# Altium schematic sheet GSM.SchDoc
size A4; PageSetup: Record=PageOptions|CenterHorizontal=True|CenterVertical=True|PrintScale=0.97|XCorrection=1.00|YCorrection=1.00|PrintKind=1|BorderSize=5000000|LeftOffset=0|BottomOffset=0|Orientation=2|PaperLength=1000|PaperWidth=1000|Scale=100|PaperSource=7|PrintQuality=-4|MediaType=1|DitherType=10|PaperKind=A4, 210x297 mm|PrintScaleMode=1
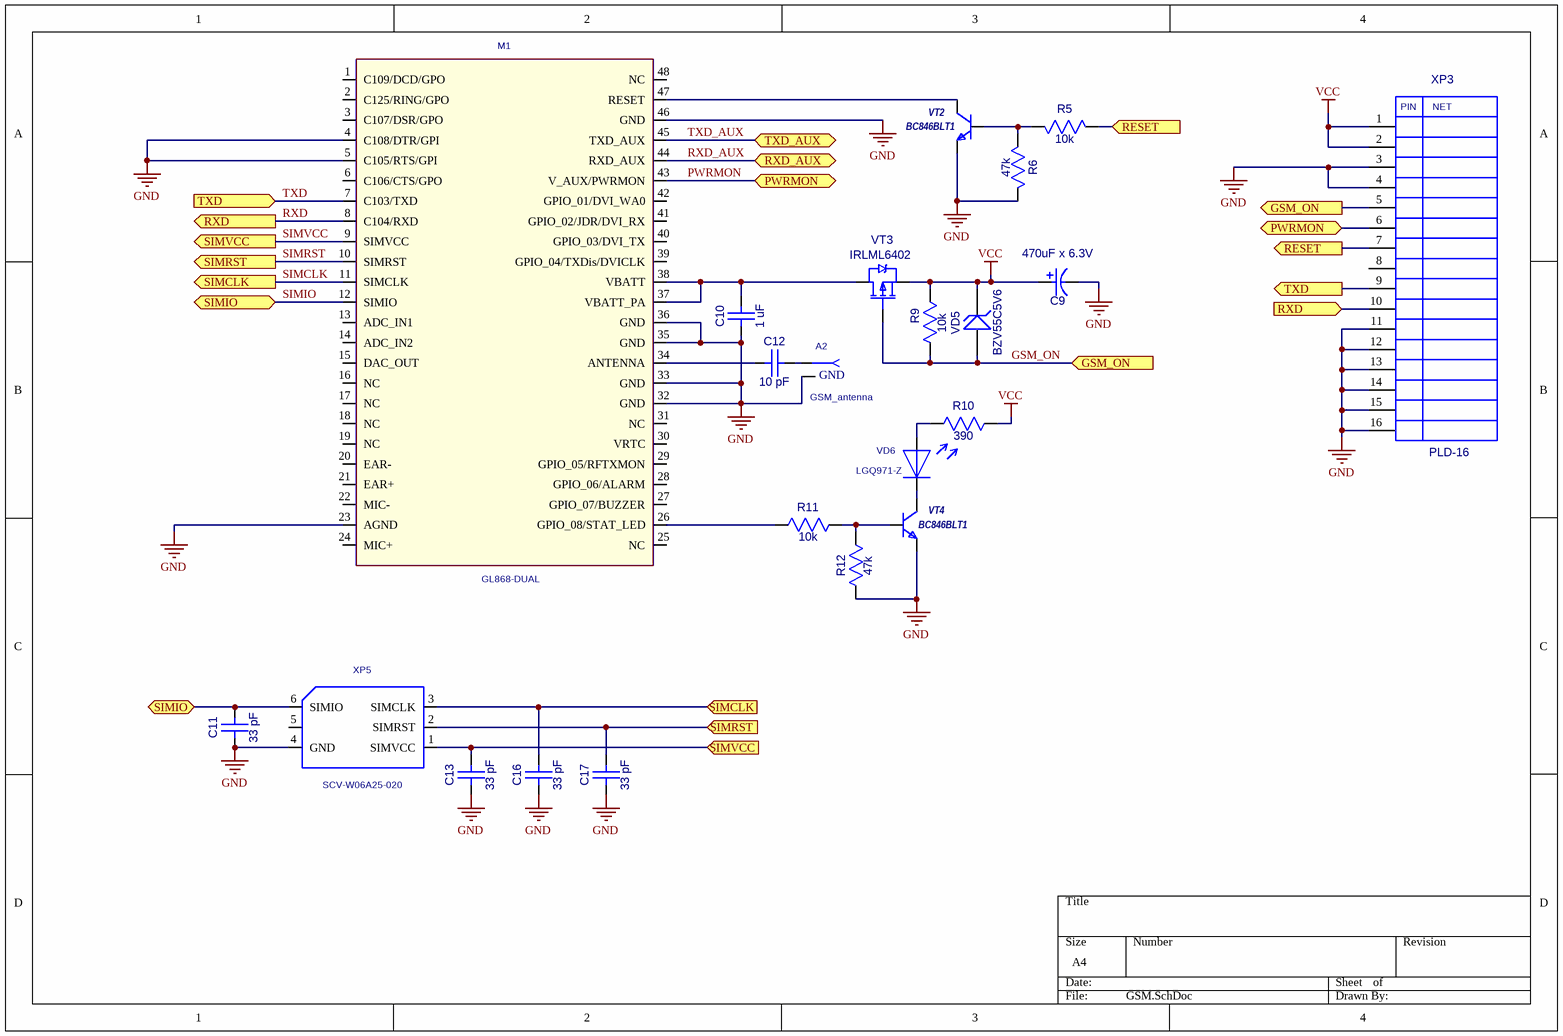
[diagram p0: GSM.SchDoc]

## Parts
A2  GSM_antenna  [GSM_antenna_pad]
C9  470uF x 6.3V  [TAJ-D-1M]
C10  1 uF  [CC0603-3M]
C11  33 pF  [CC0603-3M]
C12  10 pF  [CC0603-3M]
C13  33 pF  [CC0603-3M]
C16  33 pF  [CC0603-3M]
C17  33 pF  [CC0603-3M]
M1  GL868-DUAL  [GL868-DUAL]
R5  10k  [RC0603-3M]
R6  47k  [RC0603-3M]
R9  10k  [RC0603-3M]
R10  390  [RC0603-3M]
R11  10k  [RC0603-3M]
R12  47k  [RC0603-3M]
VD5  BZV55C5V6  [SOD80]
VD6  LGQ971-Z  [LED0603]
VT2  BC846BLT1  [SOT-23(123)]
VT3  IRLML6402  [SOT-23(123)]
VT4  BC846BLT1  [SOT-23(123)]
XP3  PLD-16  [PIN16]
XP5  SCV-W06A25-020  [SCVW06A25020]

## Ports
GSM_ON (in), GSM_ON (out), PWRMON, RESET (in), RESET (out), RXD (in), RXD (out), RXD_AUX, SIMCLK (in), SIMCLK (out), SIMIO, SIMIO (bidir), SIMRST (in), SIMRST (out), SIMVCC (in), SIMVCC (out), TXD (in), TXD (out), TXD_AUX

## Nets
GND: A2.2 C9.2(B) C10.1(A) C11.1(A) C13.1(A) C16.1(A) C17.1(A) M1.4(C108/DTR/GPI) M1.5(C105/RTS/GPI) M1.23(AGND) M1.32(GND) M1.33(GND) M1.35(GND) M1.36(GND) M1.46(GND) R6.2(B) R12.2(B) VT2.2(E) VT4.2(E) XP3.3 XP3.4 XP3.11 XP3.12 XP3.13 XP3.14 XP3.15 XP3.16 XP5.4(GND)
VCC: C9.1(A) R9.1(A) R10.2(B) VD5.2 VT3.2(S) XP3.1 XP3.2
GSM_ON: R9.2(B) VD5.1(A) VT3.1(G) XP3.5 ; port GSM_ON
PWRMON: M1.43(V_AUX/PWRMON) XP3.6 ; port PWRMON
RESET: R5.1(A) XP3.7 ; port RESET
RXD: M1.8(C104/RXD) XP3.10 ; port RXD
RXD_AUX: M1.44(RXD_AUX) ; port RXD_AUX
SIMCLK: C16.2(B) M1.11(SIMCLK) XP5.3(SIMCLK) ; port SIMCLK
SIMIO: C11.2(B) M1.12(SIMIO) XP5.6(SIMIO) ; port SIMIO
SIMRST: C17.2(B) M1.10(SIMRST) XP5.2(SIMRST) ; port SIMRST
SIMVCC: C13.2(B) M1.9(SIMVCC) XP5.1(SIMVCC) ; port SIMVCC
TXD: M1.7(C103/TXD) XP3.9 ; port TXD
TXD_AUX: M1.45(TXD_AUX) ; port TXD_AUX
NetA2_1: A2.1 C12.2(B)
NetC10_2: C10.2(B) M1.37(VBATT_PA) M1.38(VBATT) VT3.3(D)
NetC12_1: C12.1(A) M1.34(ANTENNA)
NetM1_26: M1.26(GPIO_08/STAT_LED) R11.1(A)
NetM1_47: M1.47(RESET) VT2.3(C)
NetR5_2: R5.2(B) R6.1(A) VT2.1(B)
NetR10_1: R10.1(A) VD6.1
NetR11_2: R11.2(B) R12.1(A) VT4.1(B)
NetVD6_2: VD6.2 VT4.3(C)

Not connected (* = marked no-connect by the designer): M1 1(C109/DCD/GPO) 2(C125/RING/GPO) 3(C107/DSR/GPO) 6(C106/CTS/GPO) 13(ADC_IN1) 14(ADC_IN2) 15(DAC_OUT) 16(NC) 17(NC) 18(NC) 19(NC) 20(EAR-) 21(EAR+) 22(MIC-) 24(MIC+) 25(NC) 27(GPIO_07/BUZZER) 28(GPIO_06/ALARM) 29(GPIO_05/RFTXMON) 30(VRTC) 31(NC) 39(GPIO_04/TXDis/DVICLK) 40(GPIO_03/DVI_TX) 41(GPIO_02/JDR/DVI_RX) 42(GPIO_01/DVI_WA0) 48(NC); XP3 8; XP5 5

## Notes on the sheet
- (in symbol GSM_antenna_pad) GND
- (in symbol PLD-16) PIN; NET

## Library data of the parts
A2 = GSM_antenna_pad: Value: *
C9 = TAJ-D: Value: 470uF x 6.3V
C10-C13 C16 C17 = CC0603
  C10: Value: 1 uF
  C11 C13 C16 C17: Value: 33 pF
  C12: Value: 10 pF
R5 R6 R9-R12 = RC0603
  R5 R9 R11: Value: 10k
  R6 R12: Value: 47k
  R10: Value: 390
VD5 = BZV55C5V1: Zener Voltage Regulator Diode; OriginalName: BZX84C10LT1; ComponentField6: Pin 2 is not connected and not drawn.; ComponentField7: Published 29-Sep-2000; Value: BZV55C5V6
VD6 = LED_0603: Value: LGQ971-Z
VT2 VT4 = BC846BLT1: ComponentField7: Published 29-Sep-2000; OriginalName: BC846BLT1
VT3 = IRLML6402: HEXFET Power MOSFET; OriginalName: IRLML5103; ComponentField7: Published 8-Jun-2000; Value: {Value}
M1 = GL868-DUAL: Value: *
XP3 = PLD-16: Value: *
XP5 = SCV-W06A25-020: Value: *